# EAGLE design reset_final_rev01 (EAGLE 9.6.0)
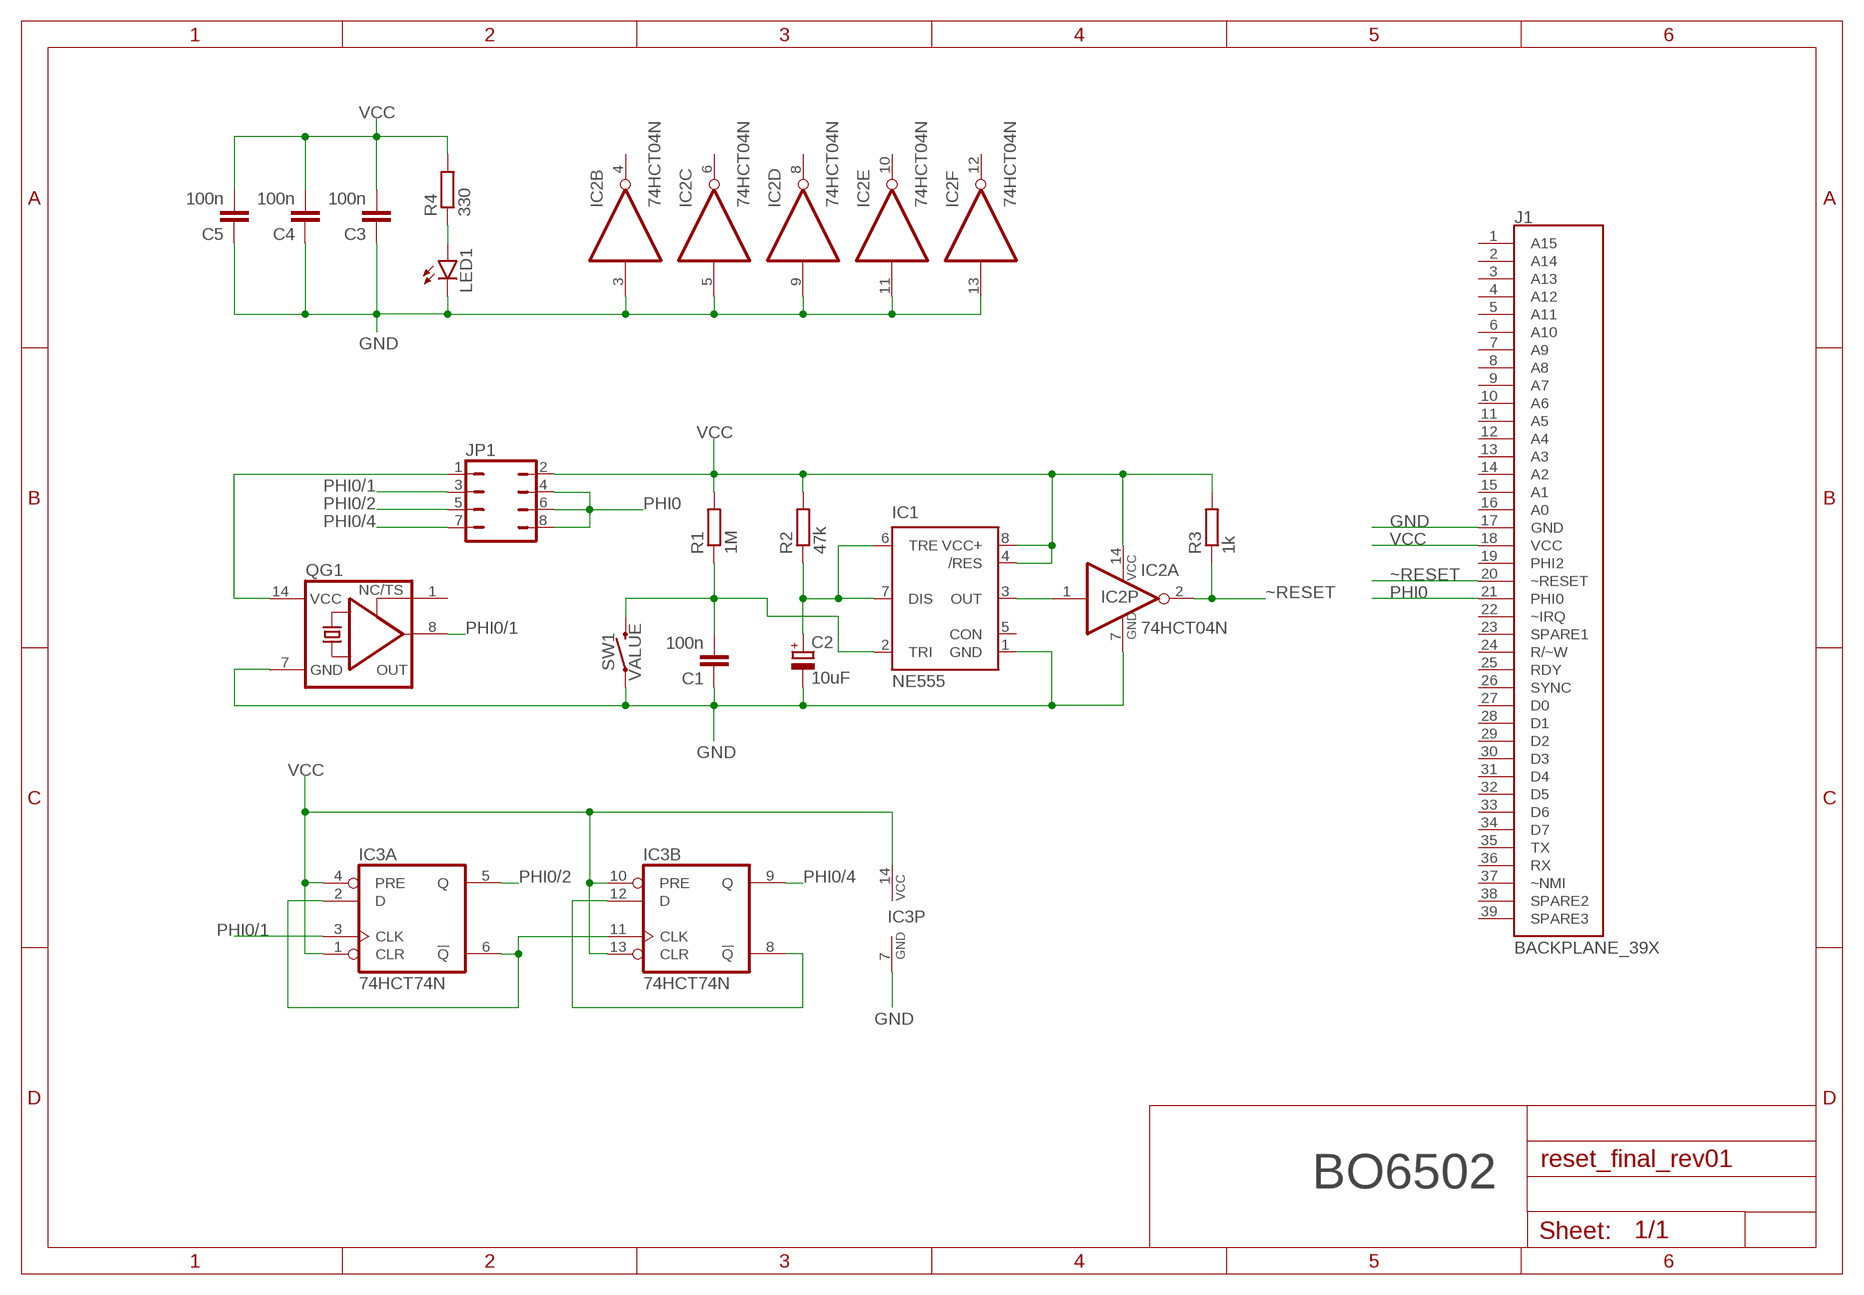
[diagram p0: schematic, sheet 1]

## Parts
C1  100n  C-EU025-025X050  [C025-025X050]
C2  10uF  CPOL-EUB45181A  [B45181A]
C3  100n  C-EU025-025X050  [C025-025X050]
C4  100n  C-EU025-025X050  [C025-025X050]
C5  100n  C-EU025-025X050  [C025-025X050]
IC1  NE555  [DIL-08]
IC2  74HCT04N  [DIL14]
IC3  74HCT74N  [DIL14]
J1  BACKPLANE_39X  [BP_39X]
JP1  JP4Q  [JP4Q]
LED1  LED5MM  [LED5MM]
QG1  XO-14  [DIL14S]
R1  1M  R-EU_0207/10  [0207/10]
R2  47k  R-EU_0207/10  [0207/10]
R3  1k  R-EU_0207/10  [0207/10]
R4  330  R-EU_0207/10  [0207/10]
SW1  MOMENTARY-SWITCH-SPST-PTH-6.0MM-KIT  [TACTILE_SWITCH_PTH_6.0MM_KIT]

## Nets
GND: C1.1 C2.- C3.1 C4.1 C5.1 IC1.1(GND) IC2.3(B:I) IC2.5(C:I) IC2.7(P:GND) IC2.9(D:I) IC2.11(E:I) IC2.13(F:I) IC3.7(P:GND) J1.17(GND) LED1.K(C) QG1.7(GND) SW1.1
N$1: JP1.1 QG1.14(VCC)
N$2: IC1.3(OUT) IC2.1(A:I)
N$3: C2.+ IC1.6(TRE) IC1.7(DIS) R2.1
N$5: C1.2 IC1.2(TRI) R1.1 SW1.3
N$6: LED1.A R4.1
N$7: IC3.2(A:D) IC3.6(A:!Q) IC3.11(B:CLK)
N$8: IC3.8(B:!Q) IC3.12(B:D)
PHI0: J1.21(PHI0) JP1.4 JP1.6 JP1.8
PHI0/1: IC3.3(A:CLK) JP1.3 QG1.8(OUT)
PHI0/2: IC3.5(A:Q) JP1.5
PHI0/4: IC3.9(B:Q) JP1.7
VCC: C3.2 C4.2 C5.2 IC1.4(/RES) IC1.8(VCC+) IC2.14(P:VCC) IC3.1(A:CLR) IC3.4(A:PRE) IC3.10(B:PRE) IC3.13(B:CLR) IC3.14(P:VCC) J1.18(VCC) JP1.2 R1.2 R2.2 R3.2 R4.2
~RESET: IC2.2(A:O) J1.20(~RESET) R3.1
Unconnected: IC1.5(CON) IC2.4(B:O) IC2.6(C:O) IC2.8(D:O) IC2.10(E:O) IC2.12(F:O) J1.1(A15) J1.2(A14) J1.3(A13) J1.4(A12) J1.5(A11) J1.6(A10) J1.7(A9) J1.8(A8) J1.9(A7) J1.10(A6) J1.11(A5) J1.12(A4) J1.13(A3) J1.14(A2) J1.15(A1) J1.16(A0) J1.19(PHI2) J1.22(~IRQ) J1.23(SPARE1) J1.24(R/~W) J1.25(RDY) J1.26(SYNC) J1.27(D0) J1.28(D1) J1.29(D2) J1.30(D3) J1.31(D4) J1.32(D5) J1.33(D6) J1.34(D7) J1.35(TX) J1.36(RX) J1.37(~NMI) J1.38(SPARE2) J1.39(SPARE3) QG1.1(TS)

## Notes on the sheet
- BO6502

## Library data of the parts
C1 C3-C5 = rcl:C-EU: CAPACITOR, European symbol; SPICEPREFIX: C
C2 = rcl:CPOL-EU: POLARIZED CAPACITOR, European symbol; SPICEPREFIX: C
IC1 = st-microelectronics:NE555: General purpose bipolar Timer; MF: Arrow Electronics; MPN: NE555N; OC_FARNELL: 1467742; OC_NEWARK: 89K1486
IC2 = 74xx-eu:74*04: Hex INVERTER
IC3 = 74xx-eu:74*74: Dual D type positive edge triggered FLIP FLOP, preset and clear
J1 = 65xx_family:BACKPLANE_39X; PIN_1: A15; PIN_2: A14; PIN_3: A13; PIN_4: A12; PIN_5: A11; PIN_6: A10; PIN_7: A9; PIN_8: A8; PIN_9: A7
JP1 = jumper:JP4Q: JUMPER
LED1 = led:LED: LED OSRAM: - CHIPLED LG R971, LG N971, LY N971, LG Q971, LY Q971, LO R971, LY R971 LH N974, LH R974 LS Q976, LO Q976, LY Q976 LO Q996 - Hyper CHIPLED LW Q18S LB Q993, LB Q99A, LB R99A - SideLED LS A670, LO A670, LY A670, LG A670, LP A670 LB A673, LV A673, LT A673, LW A673 LH A674 LY A675 LS A676, LA A676, LO A676, LY A676, LW A676 LS A679, LY A679, LG A679 - Hyper Micro SIDELED® LS Y876, LA Y876, LO Y876, LY Y876 LT Y87S - SmartLED LW L88C, LW L88S LB L89C, LB L89S, LG L890 LS L89K, LO L89K, LY L89K LS L896, LA L896, LO L896, LY L896 - TOPLED LS T670, LO T670, LY T670, LG T670, LP T670 LSG T670, LSP T670, LSY T670, LOP T670, LYG T670 LG T671, LOG T671, LSG T671 LB T673, LV T673, LT T673, LW T673 LH T674 LS T676, LA T676, LO T676, LY T676, LB T676, LH T676, LSB T676, LW T676 LB T67C, LV T67C, LT T67C, LS T67K, LO T67K, LY T67K, LW E67C LS E67B, LA E67B, LO E67B, LY E67B, LB E67C, LV E67C, LT E67C LW T67C LS T679, LY T679, LG T679 LS T770, LO T770, LY T770, LG T770, LP T770 LB T773, LV T773, LT T773, LW T773 LH T774 LS E675, LA E675, LY E675, LS T675 LS T776, LA T776, LO T776, LY T776, LB T776 LHGB T686 LT T68C, LB T68C - Hyper Mini TOPLED® LB M676 - Mini TOPLED Santana® LG M470 LS M47K, LO M47K, LY M47K Source: http://www.osram.convergy.de LUXEON: - LUMILED® LXK2-PW12-R00, LXK2-PW12-S00, LXK2-PW14-U00, LXK2-PW14-V00 LXK2-PM12-R00, LXK2-PM12-S00, LXK2-PM14-U00 LXK2-PE12-Q00, LXK2-PE12-R00, LXK2-PE12-S00, LXK2-PE14-T00, LXK2-PE14-U00 LXK2-PB12-K00, LXK2-PB12-L00, LXK2-PB12-M00, LXK2-PB14-N00, LXK2-PB14-P00, LXK2-PB14-Q00 LXK2-PR12-L00, LXK2-PR12-M00, LXK2-PR14-Q00, LXK2-PR14-R00 LXK2-PD12-Q00, LXK2-PD12-R00, LXK2-PD12-S00 LXK2-PH12-R00, LXK2-PH12-S00 LXK2-PL12-P00, LXK2-PL12-Q00, LXK2-PL12-R00 Source: www.luxeon.com KINGBRIGHT: KA-3528ASYC Source: www.kingbright.com
QG1 = crystal:XO-: CRYSTAL; OC_FARNELL: unknown; OC_NEWARK: unknown
R1-R4 = rcl:R-EU_: RESISTOR, European symbol; SPICEPREFIX: R
SW1 = SparkFun-Switches:MOMENTARY-SWITCH-SPST: Momentary Switch (Pushbutton) - SPST Normally-open (NO) SPST momentary switches (buttons, pushbuttons). Variants PTH-12MM - 12mm square, through-hole Momentary Pushbutton Switch - 12mm Square <https://www.sparkfun.com/products/9190> (COM-09190) PTH-6.0MM, PTH-6.0MM-KIT - 6.0mm square, through-hole Mini Pushbutton Switch <https://www.sparkfun.com/products/97> (COM-00097) KIT package intended for soldering kit's - only one side of pads' copper is exposed. PTH-RIGHT-ANGLE-KIT - Right-angle, through-hole Right Angle Tactile Button <https://www.sparkfun.com/products/10791> - Used on SparkFun BigTime Watch Kit <https://www.sparkfun.com/products/11734> SMD-12MM - 12mm square, surface-mount Tactile Button - SMD (12mm) <https://www.sparkfun.com/products/12993> (COM-12993) Used on SparkFun PicoBoard <https://www.sparkfun.com/products/11888> SMD-4.5MM - 4.5mm Square Trackball Switch Used on SparkFun Blackberry Trackballer Breakout <https://www.sparkfun.com/products/13169> SMD-4.6MMX2.8MM - 4.60mm x 2.80mm, surface mount Used on SparkFun Pro Micro - RP2040 <https://www.sparkfun.com/products/17717> SMD-5.2MM, SMD-5.2-REDUNDANT - 5.2mm square, surface-mount Mini Pushbutton Switch - SMD <https://www.sparkfun.com/products/8720> (COM-08720) Used on Arduino Pro Mini <https://www.sparkfun.com/products/11114> REDUNDANT package connects both switch circuits together SMD-6.0X3.5MM - 6.0 x 3.5mm, surface mount Momentary Reset Switch SMD <https://www.sparkfun.com/products/8229> (COM-08229) SMD-6.2MM-TALL - 6.2mm square, surface mount Tactile Button - SMD (6mm) <https://www.sparkfun.com/products/12992> Used on SparkFun Digital Sandbox <https://www.sparkfun.com/products/12651> SMD-RIGHT-ANGLE - Right-angle, surface mount Used on SparkFun Block for Intel® Edison - Arduino <https://www.sparkfun.com/products/13036>; PROD_ID: SWCH-08441; SF_SKU: COM-00097

## Board
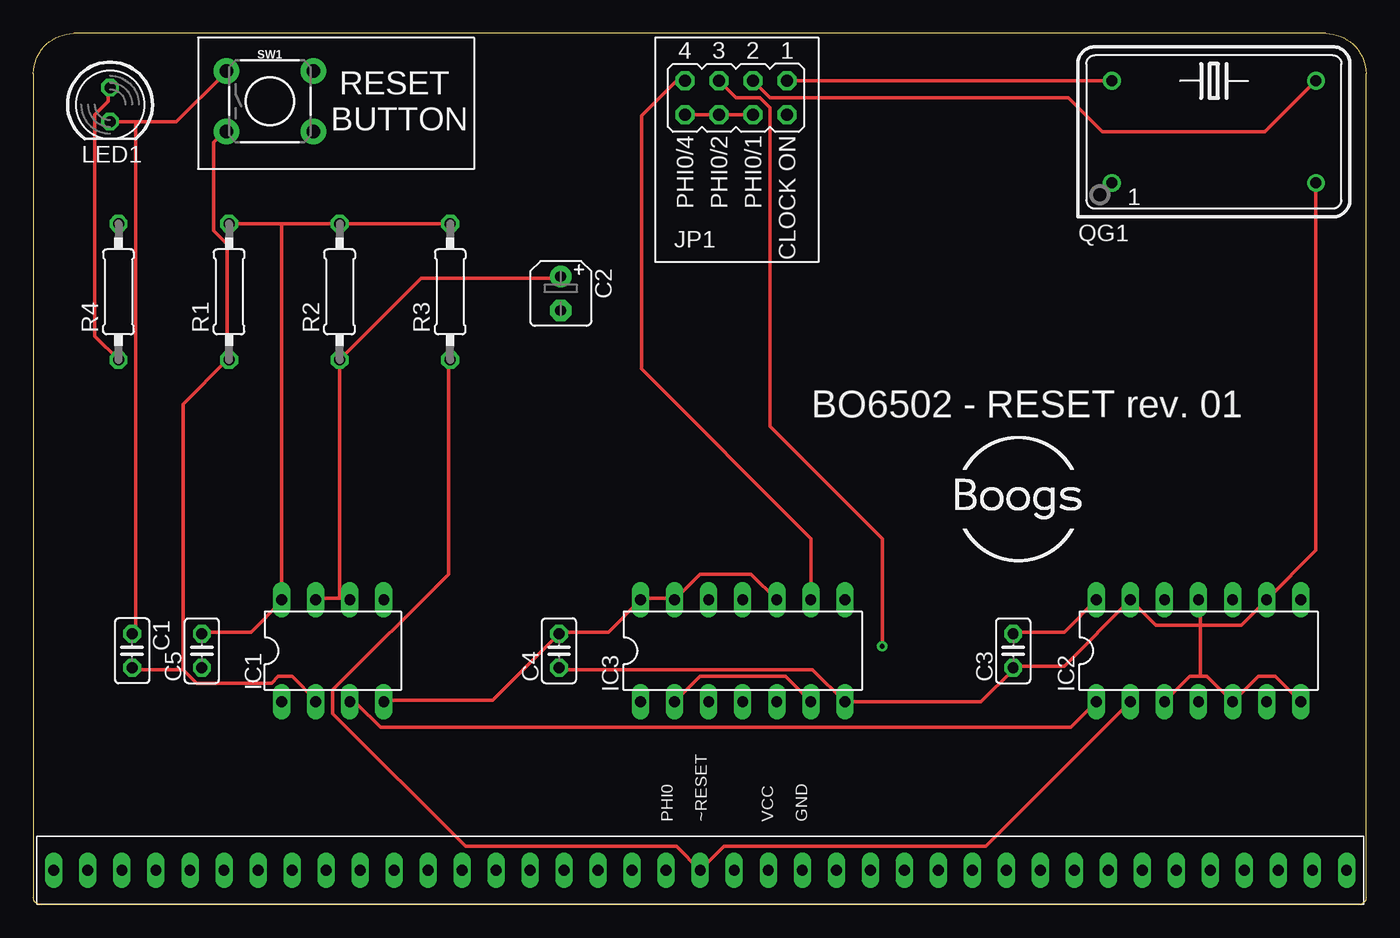
[diagram p1: board, top side]
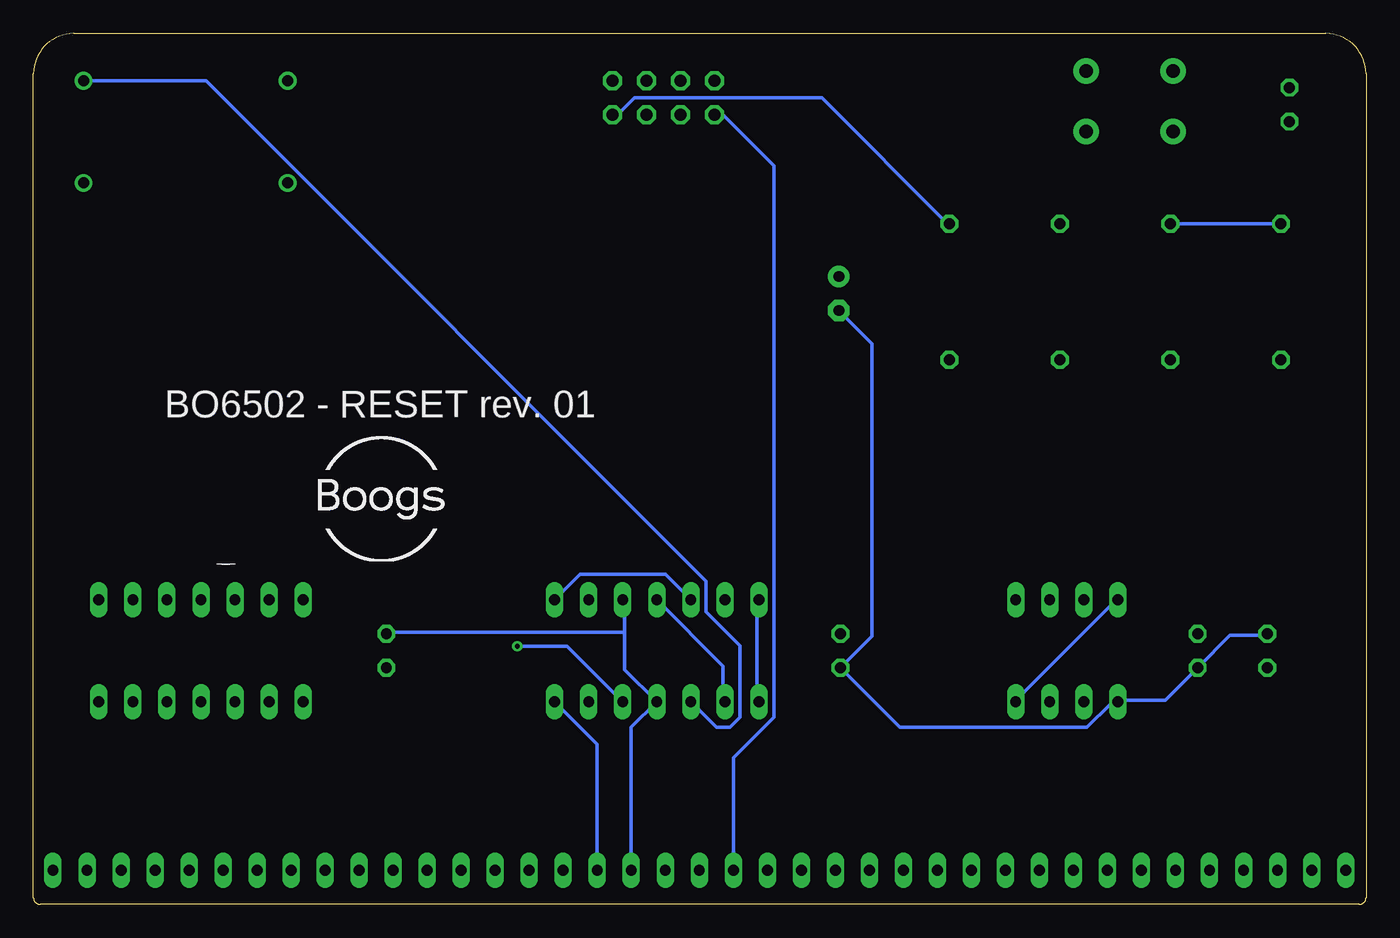
[diagram p2: board, bottom side, seen from below]

Size 99.5 x 65 mm. Coordinates in mm from the lower left corner, seen from the top.
Outline: 0.5,0 99,0 arc90 99.5,0.5 99.5,62 arc90 96.5,65 3,65 arc90 0,62 0,0.5 arc90 0.5,0
Copper layers (1*16): Top 0.035mm / dielectric 1.5mm / Bottom 0.035mm
Design rules "default *": minimum track width 10mil, minimum drill 0.35mm, track to track 10mil, track to pad 10mil, pad to pad 10mil, via to via 10mil, smd to smd 6mil, copper to edge 40mil, drill to drill 6mil, minimum pad ring 10mil, minimum via ring 8mil, stop-mask expansion 4mil, vias tented up to drill 0mil, thermal gap 10mil

### Footprints (pad centres in the part's own frame; a part is rotated, then mirrored left to right if it is on the bottom)
C025-025X050 = drill 0.813 octagon: 1 -1.27,0; 2 1.27,0
B45181A = drill 0.813 pad 1.6: + -1.27,0 | drill 0.813 pad 1.6 octagon: - 1.27,0
DIL-08 = drill 0.813 long: 1 -3.81,-3.81; 2 -1.27,-3.81; 3 1.27,-3.81; 4 3.81,-3.81; 5 3.81,3.81; 6 1.27,3.81; 7 -1.27,3.81; 8 -3.81,3.81
DIL14 = drill 0.813 long: 1 -7.62,-3.81; 2 -5.08,-3.81; 3 -2.54,-3.81; 4 0,-3.81; 5 2.54,-3.81; 6 5.08,-3.81; 7 7.62,-3.81; 8 7.62,3.81; 9 5.08,3.81; 10 2.54,3.81; 11 0,3.81; 12 -2.54,3.81; 13 -5.08,3.81; 14 -7.62,3.81
BP_39X = drill 0.813 long: 1 1.27,59.69; 2 1.27,57.15; 3 1.27,54.61; 4 1.27,52.07; 5 1.27,49.53; 6 1.27,46.99; 7 1.27,44.45; 8 1.27,41.91; 9 1.27,39.37; 10 1.27,36.83; 11 1.27,34.29; 12 1.27,31.75; 13 1.27,29.21; 14 1.27,26.67; 15 1.27,24.13; 16 1.27,21.59; 17 1.27,19.05; 18 1.27,16.51; 19 1.27,13.97; 20 1.27,11.43; 21 1.27,8.89; 22 1.27,6.35; 23 1.27,3.81; 24 1.27,1.27; 25 1.27,-1.27; 26 1.27,-3.81; 27 1.27,-6.35; 28 1.27,-8.89; 29 1.27,-11.43; 30 1.27,-13.97; 31 1.27,-16.51; 32 1.27,-19.05; 33 1.27,-21.59; 34 1.27,-24.13; 35 1.27,-26.67; 36 1.27,-29.21; 37 1.27,-31.75; 38 1.27,-34.29; 39 1.27,-36.83
JP4Q = drill 0.914 octagon: 1 -3.81,-1.27; 2 -3.81,1.27; 3 -1.27,-1.27; 4 -1.27,1.27; 5 1.27,-1.27; 6 1.27,1.27; 7 3.81,-1.27; 8 3.81,1.27
LED5MM = drill 0.813 octagon: A -1.27,0; K 1.27,0
DIL14S = drill 0.813: 1 -7.62,-3.81; 7 7.62,-3.81; 8 7.62,3.81; 14 -7.62,3.81
0207/10 = drill 0.813 octagon: 1 -5.08,0; 2 5.08,0
TACTILE_SWITCH_PTH_6.0MM_KIT = drill 1.016 pad 1.88: 1 -3.251,2.261; 2 3.251,2.261; 3 -3.251,-2.261; 4 3.251,-2.261

### Placement (x,y rotation side)
C1  7.37,18.92 270 top
C2  39.37,45.59 270 top
C3  73.15,18.92 90 top
C4  39.24,18.92 90 top
C5  12.57,18.92 90 top
IC1  22.35,18.92 0 top
IC2  87,18.92 0 top
IC3  52.96,18.92 0 top
J1  38.35,3.81 270 top
JP1  52.45,60.2 180 top
LED1  5.71,59.69 270 top
QG1  88.14,57.66 0 top
R1  14.61,45.72 90 top
R2  22.86,45.72 90 top
R3  31.11,45.72 90 top
R4  6.35,45.72 90 top
SW1  17.65,59.94 0 top

### Tracks (layer width: path | path; a pad name or v marks a point on that pad's centre or on a via)
GND
  Top 0.254: 7.62,58.42 10.67,58.42 14.22,61.98 SW1.1 | 7.62,58.42 LED1.K | 7.62,58.42 7.62,20.57 7.37,20.32 C1.1 | C4.1 39.37,17.53 58.17,17.53 IC3.7 70.73,15.11 73.15,17.53 C3.1 73.15,17.78 76.96,17.78 IC2.13 83.82,20.83 87.12,20.83 | IC2.3 86.36,17.02 87.12,17.02 | 87.12,17.02 87.63,17.02 IC2.5 91.44,17.02 92.71,17.02 IC2.7 | QG1.7 95.76,26.42 IC2.9 90.17,20.83 87.12,20.83 | 87.12,20.83 87.12,22.61 IC2.11 | 87.12,20.83 87.12,17.02
  Bottom 0.254: C1.1 7.37,20.07 10.16,20.07 C5.1 14.99,15.24 18.54,15.24 IC1.1 18.54,14.99 19.05,14.99 20.83,13.21 34.8,13.21 C4.1 36.9,20 36.9,41.85 C2.- | J1.17 57.4,11.94 IC3.7
N$1
  Top 0.254: JP1.1 QG1.14
N$2
  Top 0.254: IC2.1 77.47,13.21 25.91,13.21 24.13,14.99 23.62,14.99 IC1.3
N$3
  Top 0.254: 22.86,22.86 23.62,22.86 IC1.6 | 22.86,22.86 21.08,22.86 IC1.7 | 22.86,22.86 R2.1 28.96,46.74 39.37,46.74 C2.+
N$5
  Top 0.254: 11.18,17.53 7.37,17.53 C1.2 | 11.18,17.53 12.19,16.51 17.78,16.51 18.29,17.02 19.3,17.02 21.08,15.24 IC1.2 | 14.48,40.64 14.48,49.28 13.46,50.29 13.46,56.9 14.22,57.66 SW1.3 | 11.18,17.53 11.18,37.34 14.48,40.64 | 14.48,40.64 R1.1
N$6
  Top 0.254: R4.1 4.57,42.42 4.57,58.93 5.59,59.94 5.59,60.96 LED1.A
N$7
  Top 0.254: IC3.6 56.13,17.02 49.78,17.02 IC3.2
  Bottom 0.254: IC3.11 48.01,17.78 48.01,15.24 IC3.2
N$8
  Bottom 0.254: IC3.12 52.32,24.64 58.67,24.64 IC3.8
PHI0
  Top 0.254: JP1.4 JP1.6 JP1.8
  Bottom 0.254: J1.21 47.24,10.92 44.2,13.97 44.2,55.12 48.01,58.93 JP1.8
PHI0/1
  Top 0.254: JP1.3 54.99,60.2 77.29,60.2 79.83,57.66 91.95,57.66 QG1.8
  Bottom 0.254: IC3.3 48.51,13.21 47.5,13.21 46.74,13.97 46.74,19.3 49.28,21.84 49.28,24.13 86.61,61.47 QG1.8
PHI0/2  (via drill 0.35)
  Top 0.254: JP1.5 52.45,60.2 54.23,60.2 54.98,59.45 54.98,35.67 63.37,27.27 v63.37,19.26 63.37,19.25
  Bottom 0.254: v63.37,19.26 59.64,19.26 IC3.5
PHI0/4
  Top 0.254: JP1.7 48.01,61.47 45.4,58.86 45.4,39.96 58.06,27.3 58.06,22.71 IC3.9
VCC
  Top 0.254: R1.2 18.54,50.8 | 18.54,50.8 R2.2 R3.2 | C5.2 12.7,20.32 16.26,20.32 18.54,22.61 IC1.8 18.54,50.8 | IC2.14 76.96,20.32 73.15,20.32 C3.2 | IC3.10 53.59,24.64 49.78,24.64 IC3.13 47.75,22.86 45.47,22.86 IC3.14 42.93,20.32 39.37,20.32 C4.2 34.29,15.24 26.16,15.24 IC1.4
  Bottom 0.254: R1.2 R4.2 | JP1.2 55.88,58.93 54.61,60.2 40.64,60.2 31.24,50.8 R3.2 | IC1.4 26.16,15.24 18.54,22.86 IC1.8 | IC3.1 45.47,15.24 45.47,22.61 IC3.14 | J1.18 54.86,13.21 IC3.4 55.37,17.53 55.37,20.32 | 55.37,20.32 55.37,22.61 IC3.10 | 55.37,20.32 73.15,20.32 C3.2
~RESET
  Top 0.254: R3.1 30.99,40.64 30.99,24.64 22.35,16 22.35,14.22 32.26,4.32 48.01,4.32 J1.20 51.56,4.32 71.12,4.32 IC2.2

### Text on the board
tNames: RESET / BUTTON | PHI0/4 | PHI0/2 | PHI0/1 | CLOCK ON | BO6502 - RESET rev. 01 | PHI0 | ~RESET | VCC | GND
bNames: BO6502 - RESET rev. 01
200bmp: C:/Users/EXTREME/Pictures/boogs-high-resolution-logo.bmp